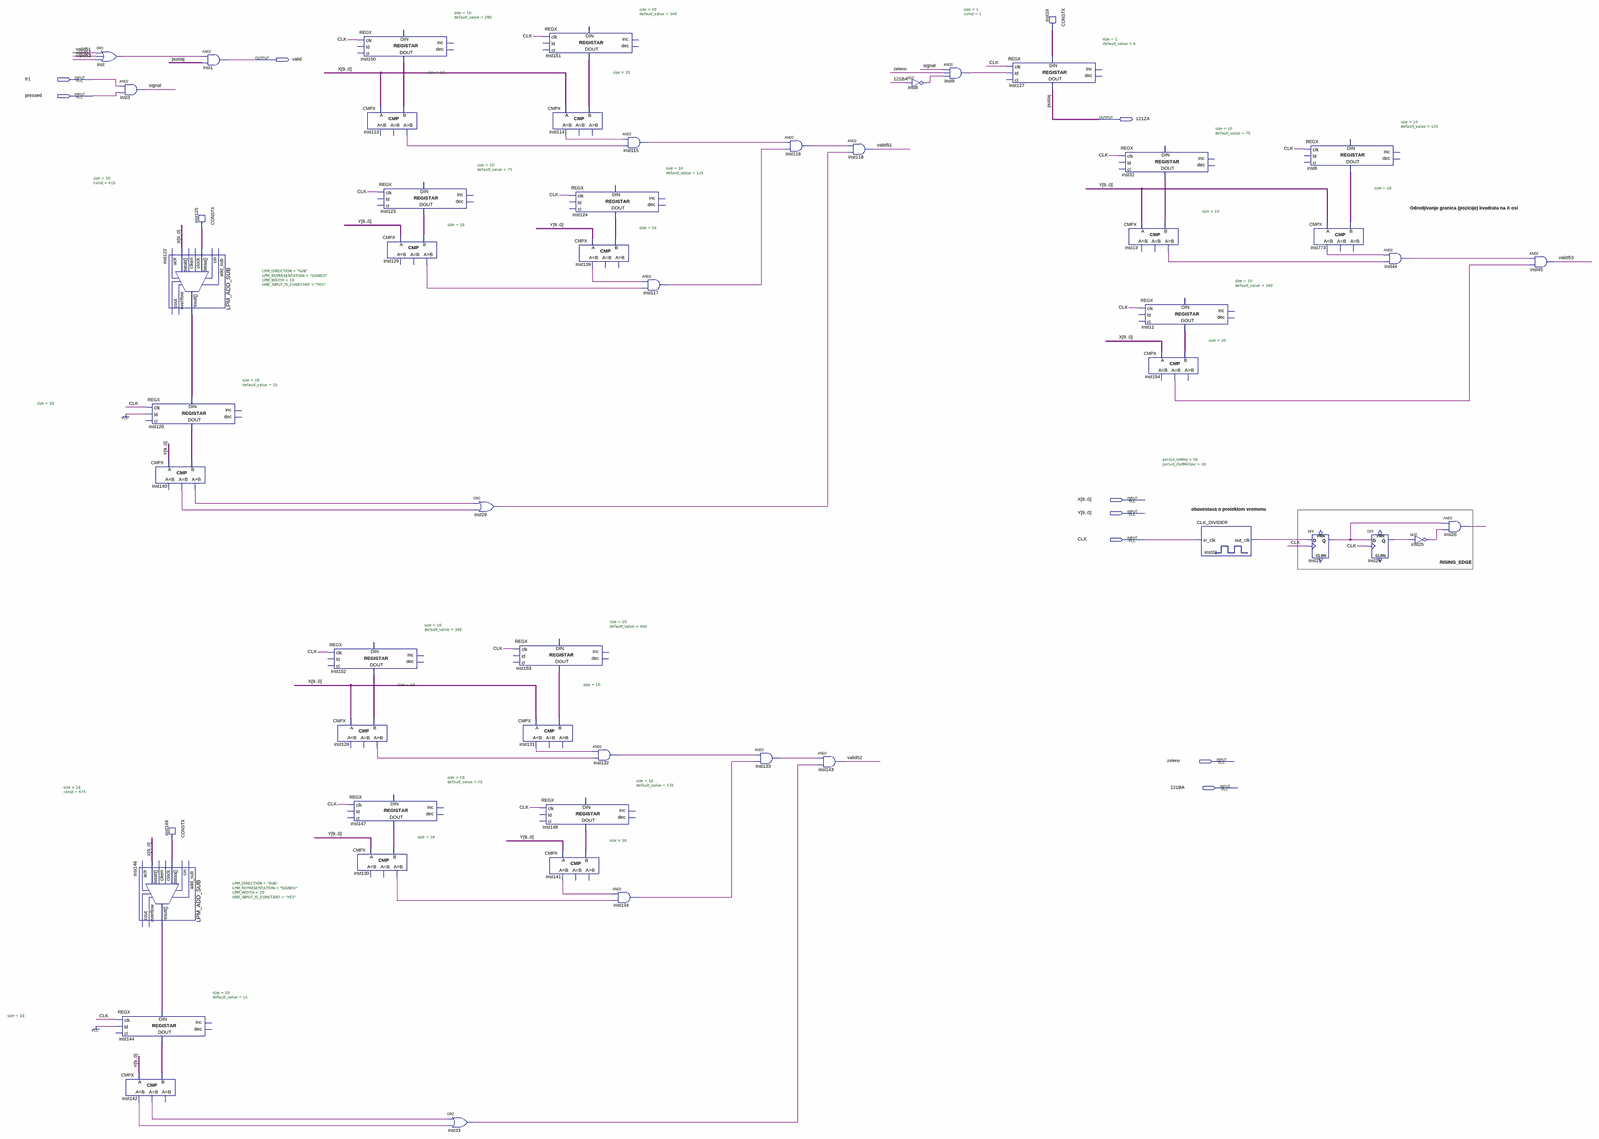
[diagram p0: schematic sheet, whole]
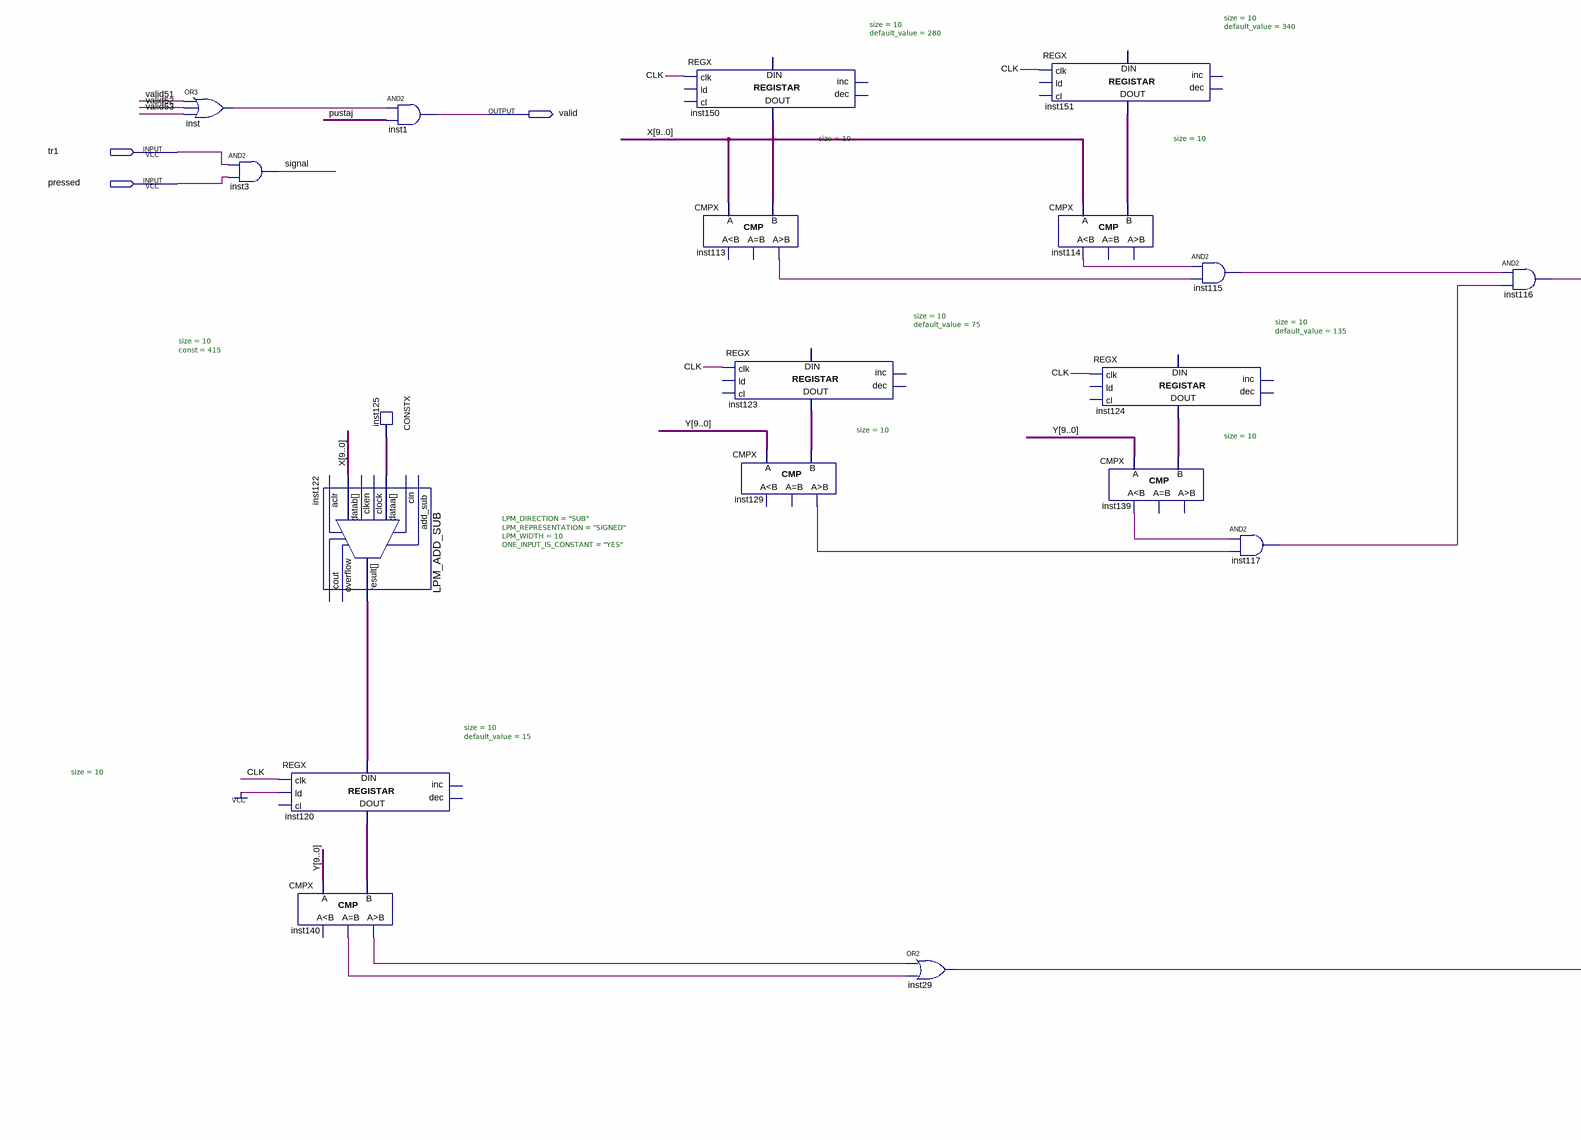
[diagram p1: schematic sheet, upper left part]
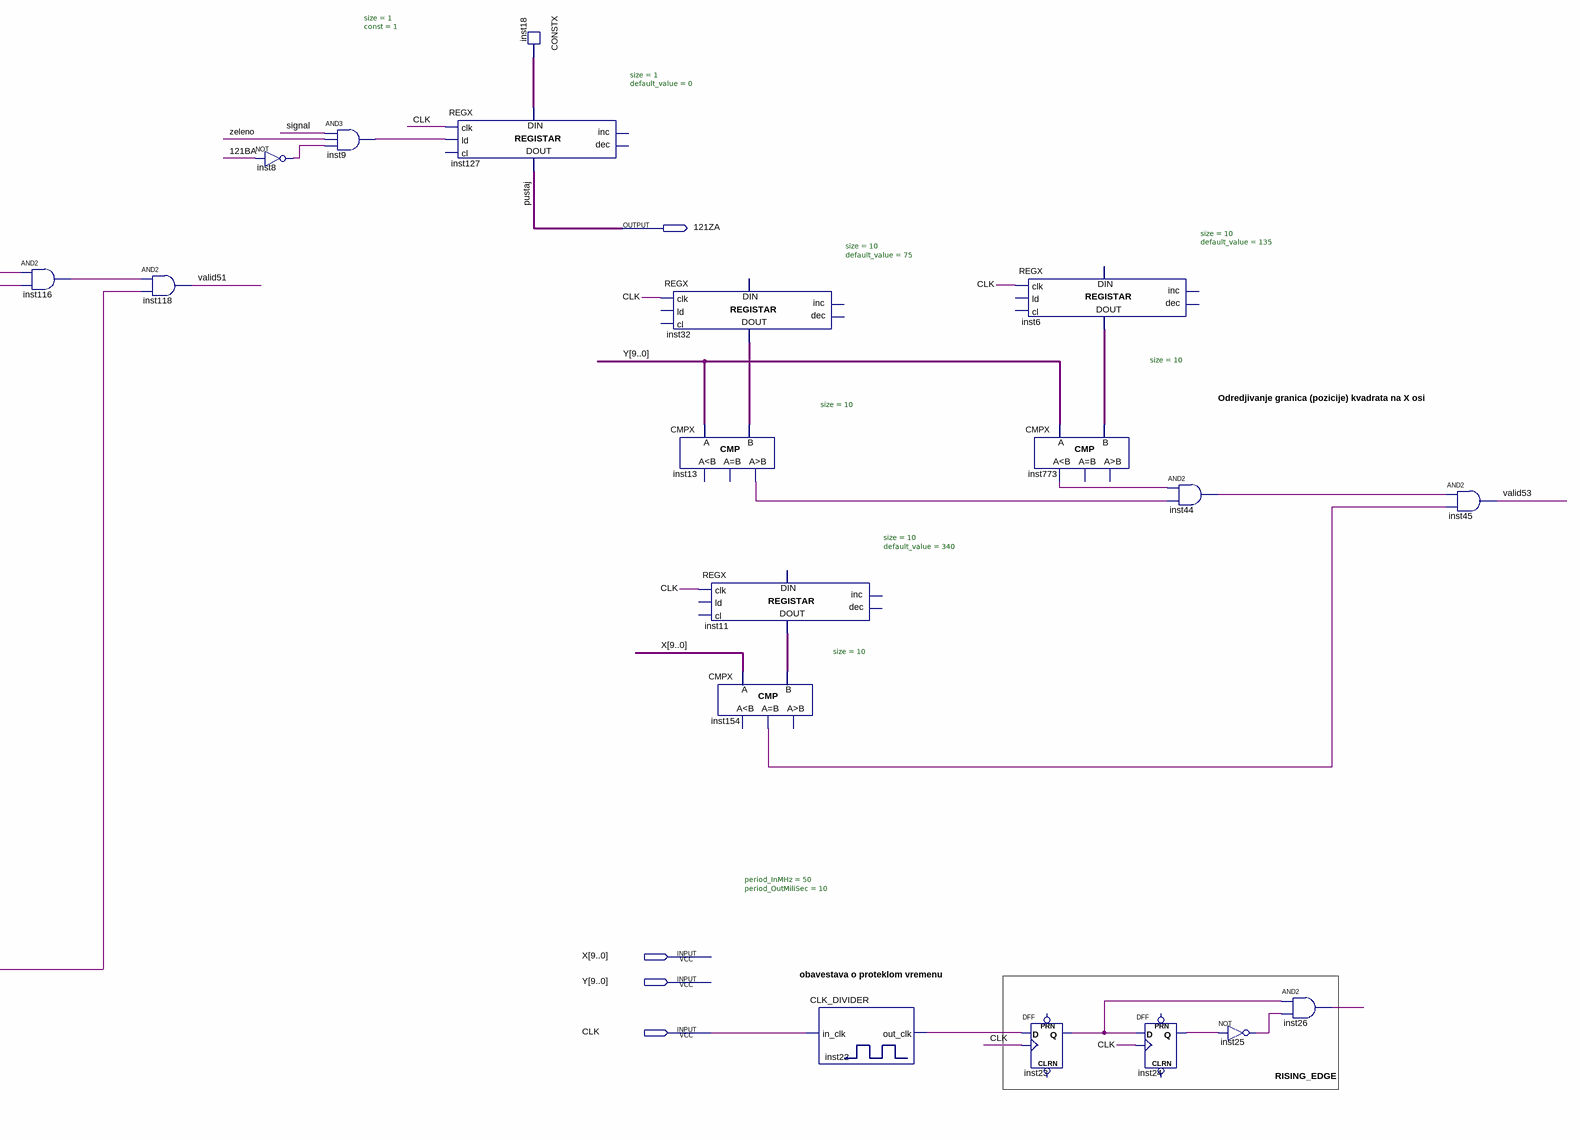
[diagram p2: schematic sheet, upper right part]
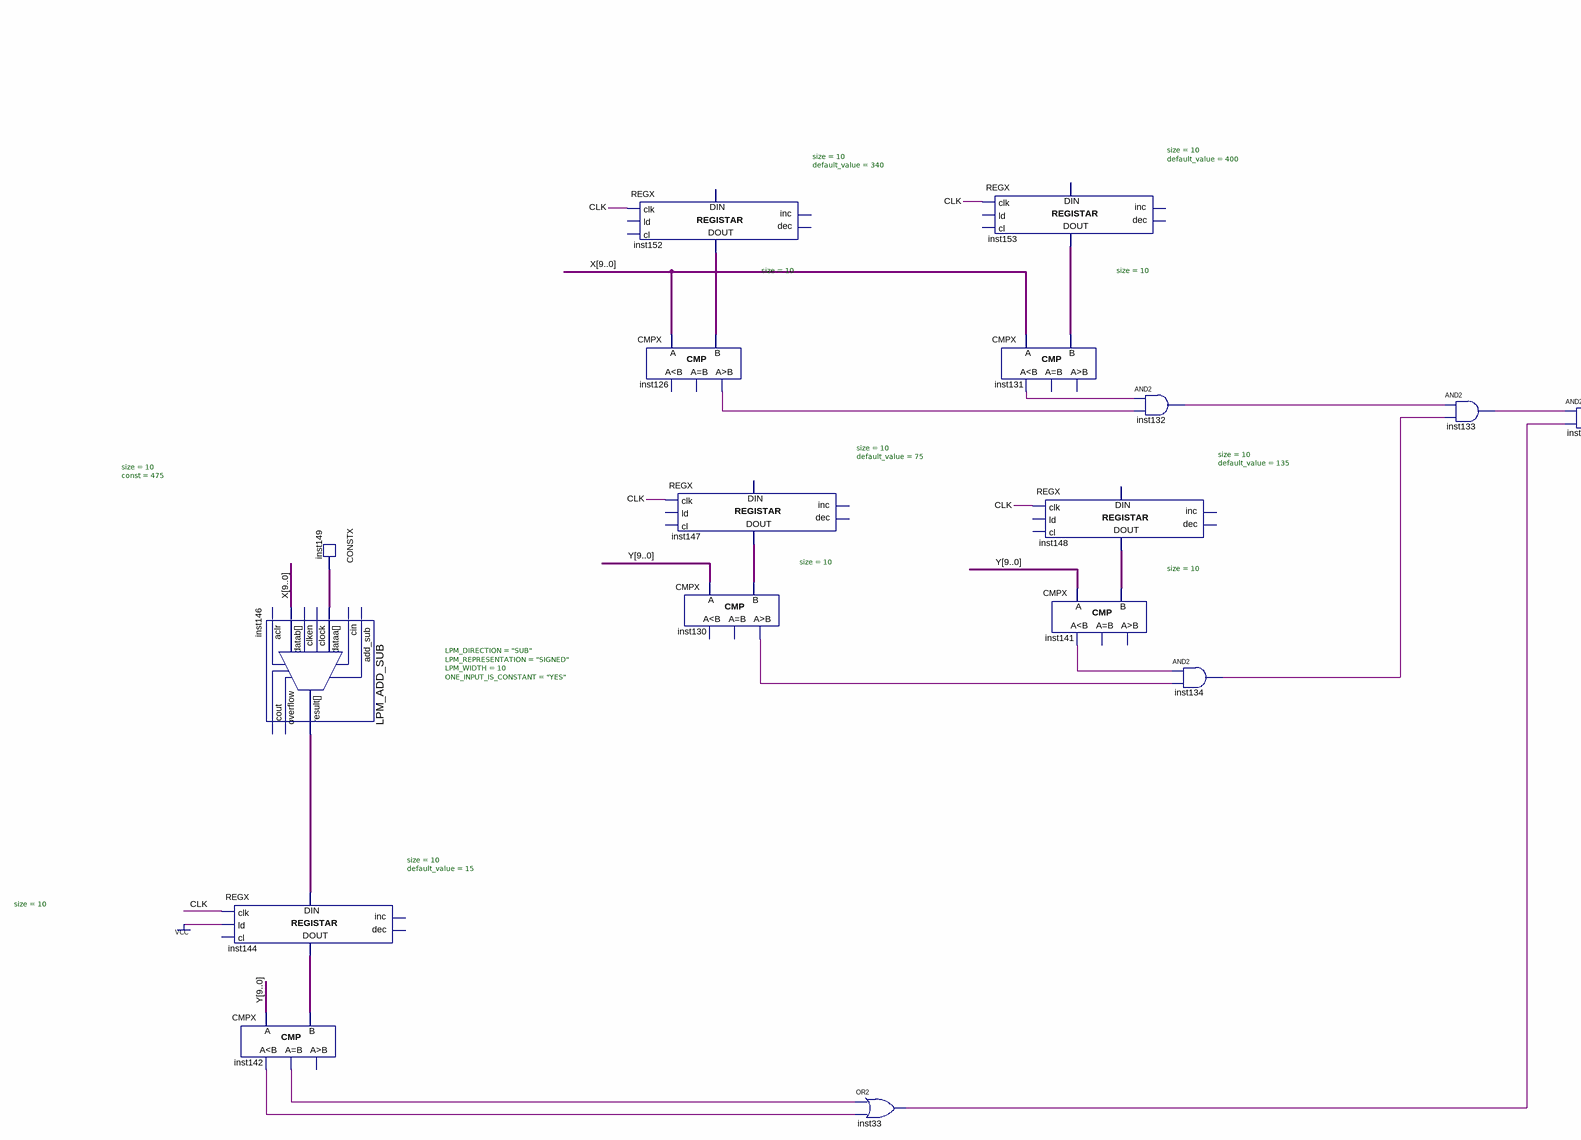
[diagram p3: schematic sheet, lower left part]
// Quartus schematic P121.bdf as structural Verilog: 54 symbols, 9 pins
module P121 (
  input  tr1,
  input  pressed,
  input  [9:0] X,
  input  [9:0] Y,
  input  CLK,
  input  zeleno,
  input  \121BA ,
  output valid,
  output \121ZA 
);

  wire inst8_out, inst9_out, inst13_gr, inst18_data, inst22_out_clk, inst23_q, inst24_q, inst25_out,
       inst26_out, inst29_out, inst33_out, inst44_out, inst113_gr, inst114_ls, inst115_out, inst116_out,
       inst117_out, inst126_gr, inst129_gr, inst130_gr, inst131_ls, inst132_out, inst133_out, inst134_out,
       inst139_ls, inst140_eq, inst140_gr, inst141_ls, inst142_eq, inst142_ls, inst154_eq, inst773_ls,
       inst_out, signal, valid51, valid52, valid53;
  wire [9:0] inst6_data_out, inst11_data_out, inst32_data_out, inst120_data_out, inst122_result,
       inst123_data_out, inst124_data_out, inst125_data, inst144_data_out, inst146_result, inst147_data_out,
       inst148_data_out, inst149_data, inst150_data_out, inst151_data_out, inst152_data_out, inst153_data_out;

  or inst (inst_out, valid51, valid52, valid53);
  and inst3 (signal, tr1, pressed);
  LPM_ADD_SUB #(.LPM_DIRECTION("SUB"), .LPM_REPRESENTATION("SIGNED"), .LPM_WIDTH(10), .ONE_INPUT_IS_CONSTANT("YES")) inst146 (
    .datab(X), .dataa(inst149_data), .result(inst146_result));  // open: add_sub, cin, aclr, clock, clken, cout, overflow
  REGX #(.size(10), .default_value(15)) inst144 (
    .clk(CLK), .ld(1'b1), .data_in(inst146_result), .data_out(inst144_data_out));  // open: cl, inc, dec
  CMPX #(.size(10)) inst142 (.A(Y), .B(inst144_data_out), .ls(inst142_ls), .eq(inst142_eq));  // open: gr
  LPM_ADD_SUB #(.LPM_DIRECTION("SUB"), .LPM_REPRESENTATION("SIGNED"), .LPM_WIDTH(10), .ONE_INPUT_IS_CONSTANT("YES")) inst122 (
    .datab(X), .dataa(inst125_data), .result(inst122_result));  // open: add_sub, cin, aclr, clock, clken, cout, overflow
  REGX #(.size(10), .default_value(15)) inst120 (
    .clk(CLK), .ld(1'b1), .data_in(inst122_result), .data_out(inst120_data_out));  // open: cl, inc, dec
  CMPX #(.size(10)) inst140 (.A(Y), .B(inst120_data_out), .eq(inst140_eq), .gr(inst140_gr));  // open: ls
  CONSTX #(.size(10), .\const (475)) inst149 (.data(inst149_data));
  and inst1 (valid, inst_out, \121ZA );
  CONSTX #(.size(10), .\const (415)) inst125 (.data(inst125_data));
  REGX #(.size(10), .default_value(340)) inst152 (
    .clk(CLK), .data_out(inst152_data_out));  // open: ld, cl, inc, dec, data_in
  CMPX #(.size(10)) inst126 (.A(X), .B(inst152_data_out), .gr(inst126_gr));  // open: ls, eq
  REGX #(.size(10), .default_value(75)) inst147 (
    .clk(CLK), .data_out(inst147_data_out));  // open: ld, cl, inc, dec, data_in
  REGX #(.size(10), .default_value(280)) inst150 (
    .clk(CLK), .data_out(inst150_data_out));  // open: ld, cl, inc, dec, data_in
  CMPX #(.size(10)) inst113 (.A(X), .B(inst150_data_out), .gr(inst113_gr));  // open: ls, eq
  CMPX #(.size(10)) inst130 (.A(Y), .B(inst147_data_out), .gr(inst130_gr));  // open: ls, eq
  REGX #(.size(10), .default_value(75)) inst123 (
    .clk(CLK), .data_out(inst123_data_out));  // open: ld, cl, inc, dec, data_in
  CMPX #(.size(10)) inst129 (.A(Y), .B(inst123_data_out), .gr(inst129_gr));  // open: ls, eq
  or inst33 (inst33_out, inst142_eq, inst142_ls);
  or inst29 (inst29_out, inst140_gr, inst140_eq);
  REGX #(.size(10), .default_value(400)) inst153 (
    .clk(CLK), .data_out(inst153_data_out));  // open: ld, cl, inc, dec, data_in
  CMPX #(.size(10)) inst131 (.A(X), .B(inst153_data_out), .ls(inst131_ls));  // open: eq, gr
  REGX #(.size(10), .default_value(340)) inst151 (
    .clk(CLK), .data_out(inst151_data_out));  // open: ld, cl, inc, dec, data_in
  CMPX #(.size(10)) inst114 (.A(X), .B(inst151_data_out), .ls(inst114_ls));  // open: eq, gr
  REGX #(.size(10), .default_value(135)) inst148 (
    .clk(CLK), .data_out(inst148_data_out));  // open: ld, cl, inc, dec, data_in
  CMPX #(.size(10)) inst141 (.A(Y), .B(inst148_data_out), .ls(inst141_ls));  // open: eq, gr
  REGX #(.size(10), .default_value(135)) inst124 (
    .clk(CLK), .data_out(inst124_data_out));  // open: ld, cl, inc, dec, data_in
  CMPX #(.size(10)) inst139 (.A(Y), .B(inst124_data_out), .ls(inst139_ls));  // open: eq, gr
  and inst132 (inst132_out, inst131_ls, inst126_gr);
  and inst134 (inst134_out, inst141_ls, inst130_gr);
  and inst115 (inst115_out, inst114_ls, inst113_gr);
  and inst117 (inst117_out, inst139_ls, inst129_gr);
  and inst133 (inst133_out, inst132_out, inst134_out);
  and inst116 (inst116_out, inst115_out, inst117_out);
  and inst143 (valid52, inst133_out, inst33_out);
  and inst118 (valid51, inst116_out, inst29_out);
  not inst8 (inst8_out, \121BA );
  and inst9 (inst9_out, signal, zeleno, inst8_out);
  REGX #(.size(1), .default_value(0)) inst127 (
    .clk(CLK), .ld(inst9_out), .data_in(inst18_data), .data_out(\121ZA ));  // open: cl, inc, dec
  CONSTX #(.size(1), .\const (1)) inst18 (.data(inst18_data));
  REGX #(.size(10), .default_value(75)) inst32 (
    .clk(CLK), .data_out(inst32_data_out));  // open: ld, cl, inc, dec, data_in
  CMPX #(.size(10)) inst13 (.A(Y), .B(inst32_data_out), .gr(inst13_gr));  // open: ls, eq
  REGX #(.size(10), .default_value(340)) inst11 (
    .clk(CLK), .data_out(inst11_data_out));  // open: ld, cl, inc, dec, data_in
  CMPX #(.size(10)) inst154 (.A(X), .B(inst11_data_out), .eq(inst154_eq));  // open: ls, gr
  CLK_DIVIDER #(.period_InMHz(50), .period_OutMiliSec(10)) inst22 (.in_clk(CLK), .out_clk(inst22_out_clk));
  REGX #(.size(10), .default_value(135)) inst6 (
    .clk(CLK), .data_out(inst6_data_out));  // open: ld, cl, inc, dec, data_in
  CMPX #(.size(10)) inst773 (.A(Y), .B(inst6_data_out), .ls(inst773_ls));  // open: eq, gr
  DFF inst23 (.CLK(CLK), .D(inst22_out_clk), .Q(inst23_q));  // open: CLRN, PRN
  DFF inst24 (.CLK(CLK), .D(inst23_q), .Q(inst24_q));  // open: CLRN, PRN
  and inst44 (inst44_out, inst773_ls, inst13_gr);
  not inst25 (inst25_out, inst24_q);
  and inst26 (inst26_out, inst23_q, inst25_out);
  and inst45 (valid53, inst44_out, inst154_eq);

  // Other names for the same wires on the sheet: pustaj = \121ZA 

  // Notes on the sheet:
  //   Odredjivanje granica (pozicije) kvadrata na X osi
  //   obavestava o proteklom vremenu
  //   RISING_EDGE
endmodule
